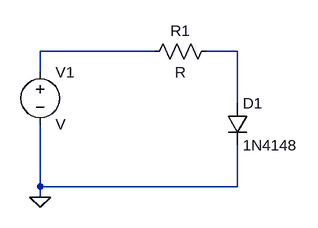
[diagram p0: schematic as2point2.asc]
as2point2.asc, the LTspice schematic file:
Version 4.1
SHEET 1 880 680
WIRE 192 32 16 32
WIRE 320 32 272 32
WIRE 16 64 16 32
WIRE 320 112 320 32
WIRE 16 240 16 144
WIRE 320 240 320 176
WIRE 320 240 16 240
WIRE 16 256 16 240
FLAG 16 256 0
SYMBOL voltage 16 48 R0
SYMATTR InstName V1
SYMBOL res 288 16 R90
WINDOW 0 0 56 VBottom 2
WINDOW 3 32 56 VTop 2
SYMATTR InstName R1
SYMBOL diode 304 112 R0
SYMATTR InstName D1
SYMATTR Value 1N4148

The netlist it stands for:
* as2point2.asc
V1 N001 0 V
R1 N002 N001 R
D1 N002 0 1N4148
.model D D
.lib standard.dio
.backanno
.end